# Altium schematic sheet RF.SchDoc
size A4
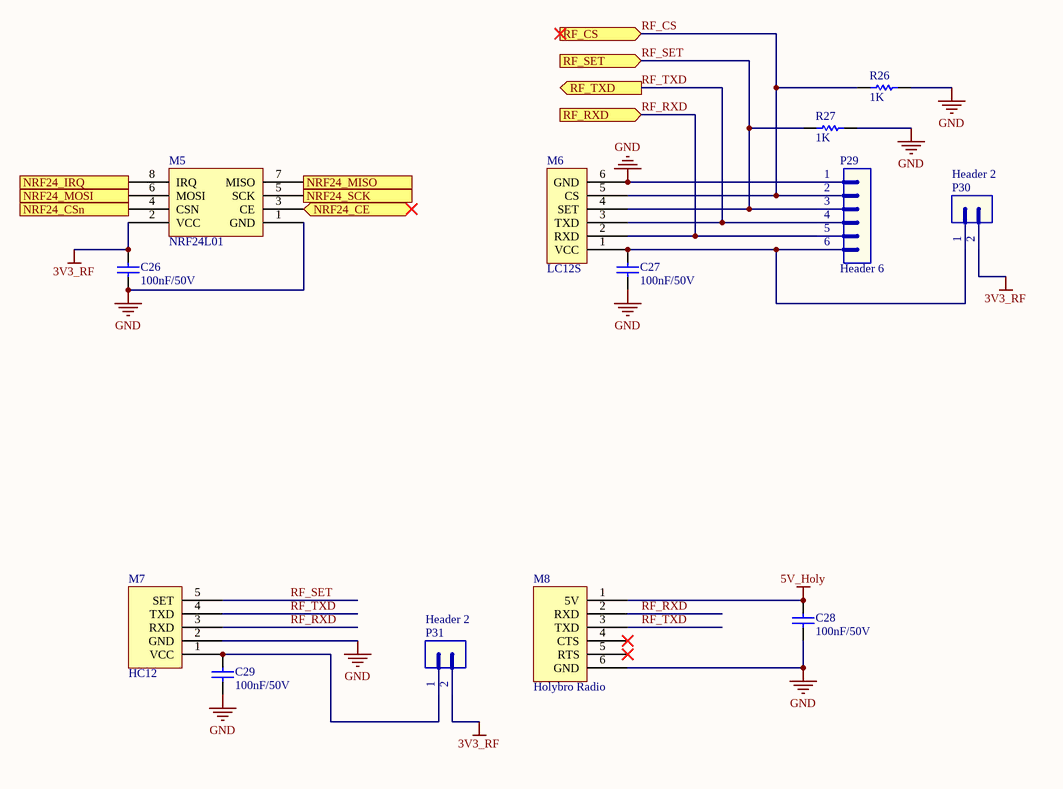
[diagram p0: RF.SchDoc]

## Parts
C26  value 100nF/50V  [CAP-SM-0805]  (hidden comment: Cap-100nF-50V-0805)
C27  value 100nF/50V  [CAP-SM-0805]  (hidden comment: Cap-100nF-50V-0805)
C28  value 100nF/50V  [CAP-SM-0805]  (hidden comment: Cap-100nF-50V-0805)
C29  value 100nF/50V  [CAP-SM-0805]  (hidden comment: Cap-100nF-50V-0805)
M5  NRF24L01  [NRF24L01]
M6  LC12S  [LC12S]
M7  HC12  [HC12]
M8  Holybro Radio  [HOLYBRO RADIO]
P29  Header 6  [JP6]
P30  Header 2  [JP2]
P31  Header 2  [JP2]
R26  value 1K  [RES-SM-0805]  (hidden comment: Res-1K-0805)
R27  value 1K  [RES-SM-0805]  (hidden comment: Res-1K-0805)

## Ports
NRF24_CE (bidir), NRF24_CSn (in), NRF24_IRQ (out), NRF24_MISO (out), NRF24_MOSI (in), NRF24_SCK (in), RF_CS (in), RF_RXD (in), RF_SET (in), RF_TXD (out)

## Nets
3V3_RF: C26.2 M5.2(VCC) P30.2 P31.2
5V_Holy: C28.2 M8.1(5V)
GND: C26.1 C27.1 C28.1 C29.1 M5.1(GND) M6.6(GND) M7.2(GND) M8.6(GND) P29.1 R26.2 R27.2
NRF24_CE: M5.3(CE) ; port NRF24_CE
NRF24_CSn: M5.4(CSN) ; port NRF24_CSn
NRF24_IRQ: M5.8(IRQ) ; port NRF24_IRQ
NRF24_MISO: M5.7(MISO) ; port NRF24_MISO
NRF24_MOSI: M5.6(MOSI) ; port NRF24_MOSI
NRF24_SCK: M5.5(SCK) ; port NRF24_SCK
RF_CS: M6.5(CS) P29.2 R26.1 ; port RF_CS
RF_RXD: M6.2(RXD) M7.3(RXD) M8.2(RXD) P29.5 ; port RF_RXD
RF_SET: M6.4(SET) M7.5(SET) P29.3 R27.1 ; port RF_SET
RF_TXD: M6.3(TXD) M7.4(TXD) M8.3(TXD) P29.4 ; port RF_TXD
NetC27_2: C27.2 M6.1(VCC) P29.6 P30.1
NetC29_2: C29.2 M7.1(VCC) P31.1

Not connected (* = marked no-connect by the designer): M8 4(CTS)* 5(RTS)*

## Notes on the sheet
- Date:
- Project:
- Number:
- 0916710807
- Self_Balancing_Robot
- Sheet
- Author:
- of
- Revision:
- 1.1
- Thanhzil&CuongCb
- Pay It Forward Club - HCMUT
- File:
- RF.schdoc

## Library data of the parts
C26-C29 = Cap-100nF-50V-0805: CAP CER 0.1UF 50V Y5V 0805; Manufacturer: Samsung Electro-Mechanics; Manufacturer Part Number: CL21F104ZBCNNNC; Local Supplier: thegioiic; Local Supplier Link: https://thegioiic.com/products/tu-100nf-0-1uf-50v-0805; Supplier 1: Digikey; Supplier 1 Part Number: 1276-1007-1-ND; Supplier 1 Link: https://www.digikey.com/product-detail/en/samsung-electro-mechanics/CL21F104ZBCNNNC/1276-1007-1-ND/3889093
P29 = Header 6: Header, 6-Pin; LatestRevisionDate: 17-Jul-2002; LatestRevisionNote: Re-released for DXP Platform.; Publisher: Altium Limited
P30 P31 = Header 2: Header, 2-Pin; LatestRevisionDate: 17-Jul-2002; LatestRevisionNote: Re-released for DXP Platform.; Publisher: Altium Limited
R26 R27 = Res-1K-0805: RES 1K OHM 1% 1/4W 0805; Manufacturer: Stackpole Electronics Inc; Manufacturer Part Number: RNCP0805FTD1K00; Local Supplier: thegioiic; Local Supplier Link: https://thegioiic.com/products/dien-tro-1k-ohm-0805-5; Supplier 1: Digikey; Supplier 1 Link: https://www.digikey.com/product-detail/en/stackpole-electronics-inc/RNCP0805FTD1K00/RNCP0805FTD1K00CT-ND/2240568; Supplier 1 Part Number: RNCP0805FTD1K00CT-ND
M5 = NRF24L01: Local Supplier Link: https://hshop.vn/products/mach-thu-phat-nrf24l01-pa-2-4ghzcu-khech-dai-cung-suat-thu-phat; Local Supplier Part Number: HS000888; Manufacturer: *; Manufacturer Part Number: *; Local Supplier: HShop
M6 = LC12S: Local Supplier: HShop; Local Supplier Link: https://hshop.vn/products/mach-thu-phat-rf-uart-lc12s-2-4ghz; Local Supplier Part Number: HS000895; Manufacturer: *; Manufacturer Part Number: *
M7 = HC12: Local Supplier Link: https://hshop.vn/products/mach-thu-phat-rf-uart-si4463-433mhzkhoang-coch-1km; Local Supplier Part Number: HS000897; Manufacturer: *; Manufactuer Part Number: *; Local Supplier: HShop
M8 = HOLYBRO RADIO: Supploer Part Number: *; Supplier: *; Supploer Link: https://www.lazada.vn/products/ld-holybro-433mhz-915-mhz-500-mw-thu-phat-vo-tuyen-xa-bo-v3-cho-pixhawk-4-dieu-khien-chuyen-bay-i430804435-s768474304.html?spm=a2o4n.searchlist.list.4.25396b19yIS9XO&search=1; Manufacturer Part Number: *; Manufacturer: *